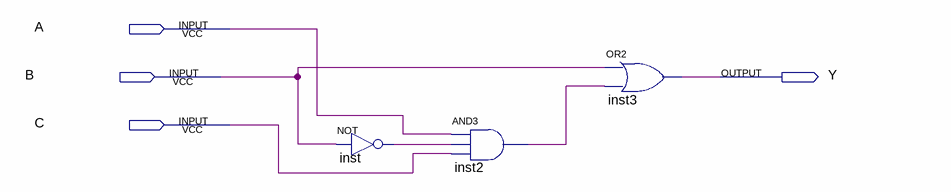
[diagram p0: schematic sheet]
// Quartus schematic kmap_demo.bdf as structural Verilog: 3 symbols, 4 pins
module kmap_demo (
  input  A,
  input  B,
  input  C,
  output Y
);

  wire inst2_out, inst_out;

  not inst (inst_out, B);
  and inst2 (inst2_out, A, inst_out, C);
  or inst3 (Y, B, inst2_out);
endmodule
